# EAGLE design stm32 (EAGLE 9.6.2)
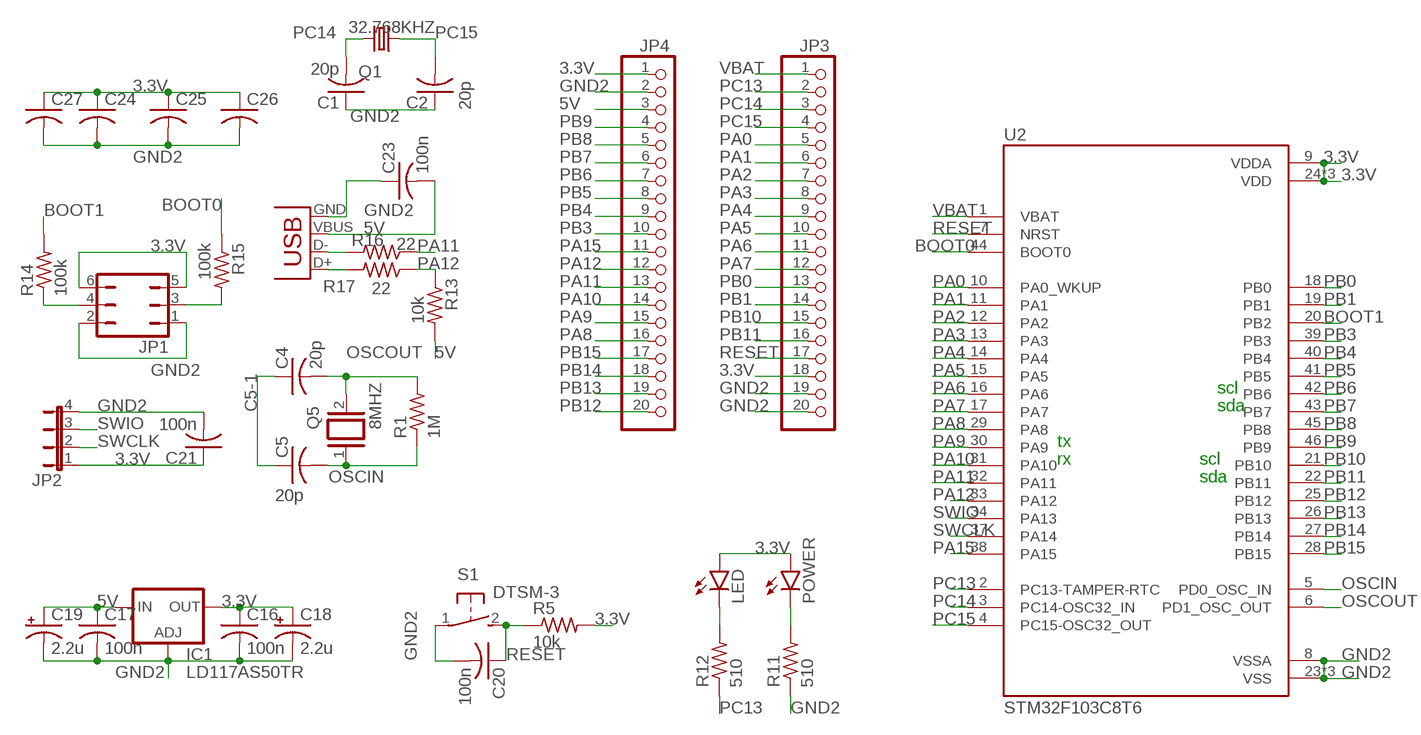
[diagram p0: schematic, sheet 1]

## Parts
C1  20p  C-USC1206  [C1206]
C2  20p  C-USC1206  [C1206]
C4  20p  C-USC1206  [C1206]
C5  20p  C-USC1206  [C1206]
C16  100n  C-USC1206  [C1206]
C17  100n  C-USC1206  [C1206]
C18  2.2u  CPOL-USE2-5  [E2-5]
C19  2.2u  CPOL-USE2-5  [E2-5]
C20  100n  C-USC1206  [C1206]
C21  100n  C-USC1206  [C1206]
C23  100n  C-USC1206  [C1206]
C24  C-USC1206  [C1206]
C25  C-USC1206  [C1206]
C26  C-USC1206  [C1206]
C27  C-USC1206  [C1206]
IC1  LD117AS50TR  [SOT223]
JP1  JP3Q  [JP3Q]
JP2  JP4E  [JP4]
JP3  PINHD-1X20  [1X20]
JP4  PINHD-1X20  [1X20]
LED  LEDCHIPLED_1206  [CHIPLED_1206]
POWER  LEDCHIPLED_1206  [CHIPLED_1206]
Q1  32.768KHZ  CRYSTALTC26H  [TC26H]
Q5  8MHZ  XTAL/S  [QS]
R1  1M  R-US_R1206  [R1206]
R5  10k  R-US_R1206  [R1206]
R11  510  R-US_R1206  [R1206]
R12  510  R-US_R1206  [R1206]
R13  10k  R-US_R1206  [R1206]
R14  100k  R-US_R1206  [R1206]
R15  100k  R-US_R1206  [R1206]
R16  22  R-US_R1206  [R1206]
R17  22  R-US_R1206  [R1206]
S1  DTSM-3  [DTSM-3]
U2  STM32F103C8T6  [QFP50P900X900X160-48N]
X1  USB-MB-S  [USB-MB-S]

## Nets
3.3V: C16.1 C18.+ C21.1 C24.1 C25.1 C26.1 C27.1 IC1.4(OUT) JP1.5 JP1.6 JP2.1 JP3.18 JP4.1 LED.A POWER.A R5.2 U2.9(VDDA) U2.24(VDD) U2.36(VDD) U2.48(VDD)
5V: C17.1 C19.+ C23.2 IC1.3(IN) JP4.3 R13.2 X1.VBUS
BOOT0: R15.1 U2.44(BOOT0)
BOOT1: R14.2 U2.20(PB2)
C5-1: C4.1 C5.1
GND2: C1.1 C2.1 C16.2 C17.2 C18.- C19.- C20.2 C21.2 C23.1 C24.2 C25.2 C26.2 C27.2 IC1.1(ADJ) JP1.1 JP1.2 JP2.4 JP3.19 JP3.20 JP4.2 R11.1 S1.1 U2.8(VSSA) U2.23(VSS) U2.35(VSS) U2.47(VSS) X1.GND
N$5: LED.C R12.2
N$6: POWER.C R11.2
N$8: JP1.3 R15.2
N$11: JP1.4 R14.1
N$19: R16.2 X1.D-
N$21: R17.2 X1.D+
OSCIN: C5.2 Q5.1 R1.1 U2.5(PD0_OSC_IN)
OSCOUT: C4.2 Q5.2 R1.2 U2.6(PD1_OSC_OUT)
PA0: JP3.5 U2.10(PA0_WKUP)
PA1: JP3.6 U2.11(PA1)
PA2: JP3.7 U2.12(PA2)
PA3: JP3.8 U2.13(PA3)
PA4: JP3.9 U2.14(PA4)
PA5: JP3.10 U2.15(PA5)
PA6: JP3.11 U2.16(PA6)
PA7: JP3.12 U2.17(PA7)
PA8: JP4.16 U2.29(PA8)
PA9: JP4.15 U2.30(PA9)
PA10: JP4.14 U2.31(PA10)
PA11: JP4.13 R16.1 U2.32(PA11)
PA12: JP4.12 R13.1 R17.1 U2.33(PA12)
PA15: JP4.11 U2.38(PA15)
PB0: JP3.13 U2.18(PB0)
PB1: JP3.14 U2.19(PB1)
PB3: JP4.10 U2.39(PB3)
PB4: JP4.9 U2.40(PB4)
PB5: JP4.8 U2.41(PB5)
PB6: JP4.7 U2.42(PB6)
PB7: JP4.6 U2.43(PB7)
PB8: JP4.5 U2.45(PB8)
PB9: JP4.4 U2.46(PB9)
PB10: JP3.15 U2.21(PB10)
PB11: JP3.16 U2.22(PB11)
PB12: JP4.20 U2.25(PB12)
PB13: JP4.19 U2.26(PB13)
PB14: JP4.18 U2.27(PB14)
PB15: JP4.17 U2.28(PB15)
PC13: JP3.2 R12.1 U2.2(PC13-TAMPER-RTC)
PC14: C1.2 JP3.3 Q1.2 U2.3(PC14-OSC32_IN)
PC15: C2.2 JP3.4 Q1.1 U2.4(PC15-OSC32_OUT)
RESET: C20.1 JP3.17 R5.1 S1.2 U2.7(NRST)
SWCLK: JP2.2 U2.37(PA14)
SWIO: JP2.3 U2.34(PA13)
VBAT: JP3.1 U2.1(VBAT)

## Notes on the sheet
- scl
- sda
- tx
- rx | scl
- sda

## Library data of the parts
C1 C2 C4 C5 C16 C17 C20 C21 C23-C27 = rcl:C-US: CAPACITOR, American symbol; SPICEPREFIX: C
C18 C19 = rcl:CPOL-US: POLARIZED CAPACITOR, American symbol; SPICEPREFIX: C
IC1 = v-reg:LD117A?*: Low drop fixed and adjustable positive voltage regulators 1 A Source: http://www.st.com/stonline/products/literature/ds/7194/ld1117axx.pdf
JP1 = jumper:JP3Q: JUMPER
JP2 = jumper:JP4E: JUMPER
JP3 JP4 = MIA_LIBRARY-2-2-2:PINHD-1X20: PIN HEADER
LED POWER = led:LED: LED OSRAM: - CHIPLED LG R971, LG N971, LY N971, LG Q971, LY Q971, LO R971, LY R971 LH N974, LH R974 LS Q976, LO Q976, LY Q976 LO Q996 - Hyper CHIPLED LW Q18S LB Q993, LB Q99A, LB R99A - SideLED LS A670, LO A670, LY A670, LG A670, LP A670 LB A673, LV A673, LT A673, LW A673 LH A674 LY A675 LS A676, LA A676, LO A676, LY A676, LW A676 LS A679, LY A679, LG A679 - Hyper Micro SIDELED® LS Y876, LA Y876, LO Y876, LY Y876 LT Y87S - SmartLED LW L88C, LW L88S LB L89C, LB L89S, LG L890 LS L89K, LO L89K, LY L89K LS L896, LA L896, LO L896, LY L896 - TOPLED LS T670, LO T670, LY T670, LG T670, LP T670 LSG T670, LSP T670, LSY T670, LOP T670, LYG T670 LG T671, LOG T671, LSG T671 LB T673, LV T673, LT T673, LW T673 LH T674 LS T676, LA T676, LO T676, LY T676, LB T676, LH T676, LSB T676, LW T676 LB T67C, LV T67C, LT T67C, LS T67K, LO T67K, LY T67K, LW E67C LS E67B, LA E67B, LO E67B, LY E67B, LB E67C, LV E67C, LT E67C LW T67C LS T679, LY T679, LG T679 LS T770, LO T770, LY T770, LG T770, LP T770 LB T773, LV T773, LT T773, LW T773 LH T774 LS E675, LA E675, LY E675, LS T675 LS T776, LA T776, LO T776, LY T776, LB T776 LHGB T686 LT T68C, LB T68C - Hyper Mini TOPLED® LB M676 - Mini TOPLED Santana® LG M470 LS M47K, LO M47K, LY M47K Source: http://www.osram.convergy.de LUXEON: - LUMILED® LXK2-PW12-R00, LXK2-PW12-S00, LXK2-PW14-U00, LXK2-PW14-V00 LXK2-PM12-R00, LXK2-PM12-S00, LXK2-PM14-U00 LXK2-PE12-Q00, LXK2-PE12-R00, LXK2-PE12-S00, LXK2-PE14-T00, LXK2-PE14-U00 LXK2-PB12-K00, LXK2-PB12-L00, LXK2-PB12-M00, LXK2-PB14-N00, LXK2-PB14-P00, LXK2-PB14-Q00 LXK2-PR12-L00, LXK2-PR12-M00, LXK2-PR14-Q00, LXK2-PR14-R00 LXK2-PD12-Q00, LXK2-PD12-R00, LXK2-PD12-S00 LXK2-PH12-R00, LXK2-PH12-S00 LXK2-PL12-P00, LXK2-PL12-Q00, LXK2-PL12-R00 Source: www.luxeon.com KINGBRIGHT: KA-3528ASYC Source: www.kingbright.com
Q1 = crystal:CRYSTAL: CRYSTAL; OC_FARNELL: unknown; OC_NEWARK: unknown
Q5 = special:XTAL/S: CRYSTAL
R1 R5 R11-R17 = rcl:R-US_: RESISTOR, American symbol; SPICEPREFIX: R
S1 = switch-tact:DTSM-3
U2 = STM32F103C8T6:STM32F103C8T6: Mainstream Performance line, ARM Cortex-M3 MCU with 64 Kbytes Flash, 72 MHz CPU, motor control, USB and CAN; AVAILABILITY: Unavailable; DESCRIPTION: Mainstream Performance line, ARM Cortex-M3 MCU with 64 Kbytes Flash, 72 MHz CPU, motor control, USB and CAN; MF: STMicroelectronics; MP: STM32F103C8T6; PACKAGE: LQFP-48 STMicroelectronics; PRICE: None
X1 = MIA_LIBRARY (2):USB: USB Connectors

## Board
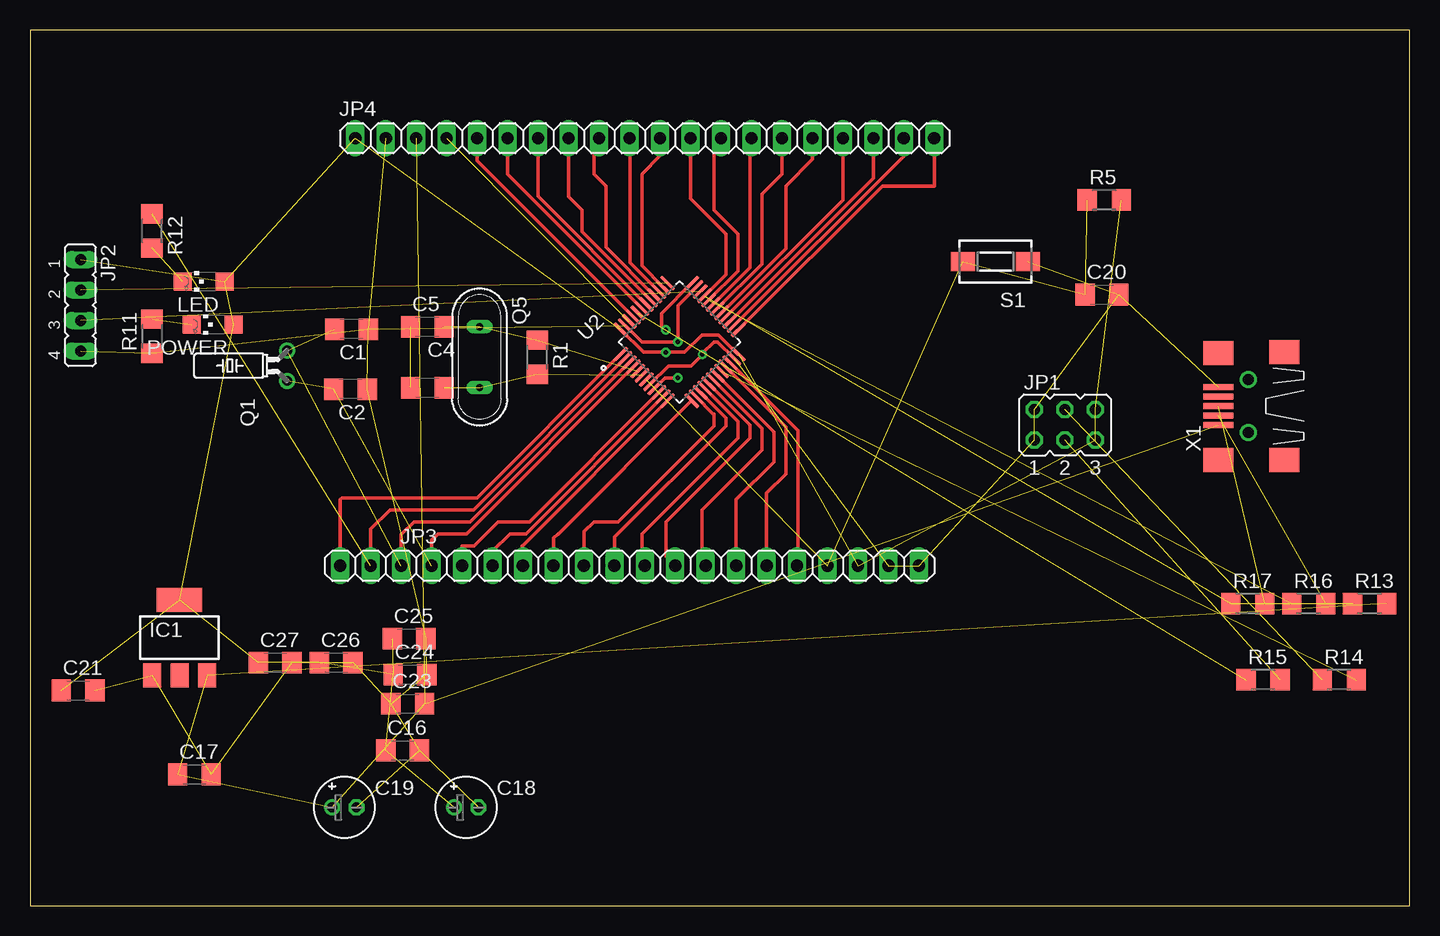
[diagram p1: board, top side]
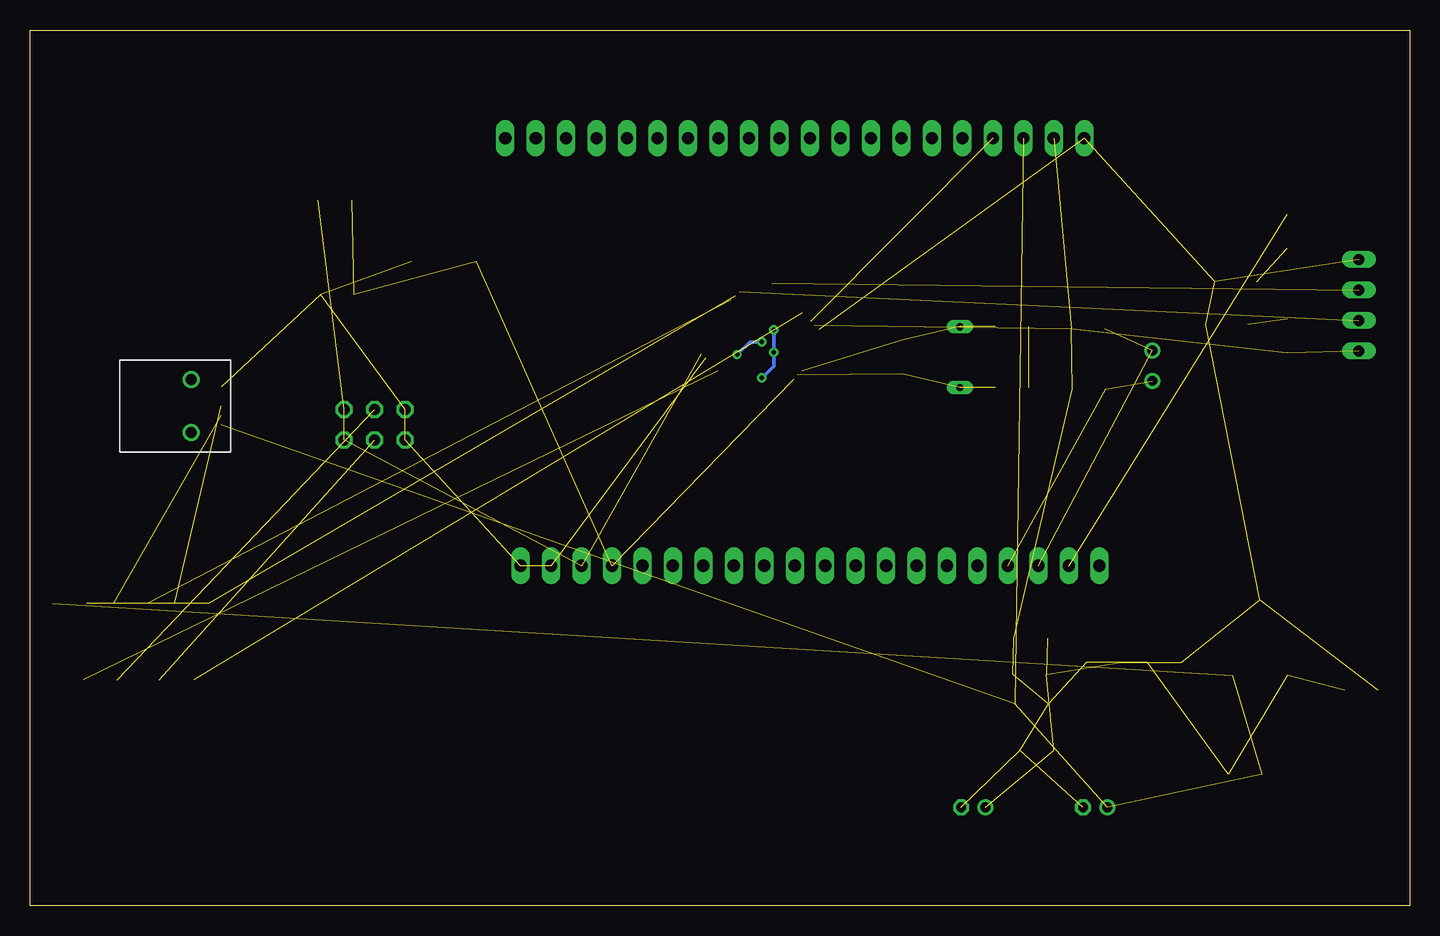
[diagram p2: board, bottom side, seen from below]

Size 115 x 73 mm. Coordinates in mm from the lower left corner, seen from the top.
Outline: 0,0 115,0 115,73 0,73 0,0
Copper layers (1*16): Top 0.035mm / dielectric 1.5mm / Bottom 0.035mm
Design rules "default": minimum track width 6mil, minimum drill 0.35mm, track to track 6mil, track to pad 6mil, pad to pad 6mil, via to via 6mil, smd to smd 6mil, copper to edge 40mil, drill to drill 6mil, minimum pad ring 10mil, minimum via ring 8mil, stop-mask expansion 4mil, vias tented up to drill 0mil, thermal gap 10mil

### Footprints (pad centres in the part's own frame; a part is rotated, then mirrored left to right if it is on the bottom)
C1206 = smd 1.6 x 1.8: 1 -1.4,0; 2 1.4,0
E2-5 = drill 0.813 pad 1.27: + -1.016,0 | drill 0.813 pad 1.27 octagon: - 1.016,0
SOT223 = smd 1.5 x 2: 1 -2.3,-3.15; 2 0,-3.15; 3 2.3,-3.15 | smd 3.8 x 2: 4 0,3.15
JP3Q = drill 0.914 octagon: 1 -2.54,-1.27; 2 -2.54,1.27; 3 0,-1.27; 4 0,1.27; 5 2.54,-1.27; 6 2.54,1.27
JP4 = drill 0.914 long: 1 -3.81,0; 2 -1.27,0; 3 1.27,0; 4 3.81,0
1X20 = drill 1.016 long: 1 -24.13,0; 2 -21.59,0; 3 -19.05,0; 4 -16.51,0; 5 -13.97,0; 6 -11.43,0; 7 -8.89,0; 8 -6.35,0; 9 -3.81,0; 10 -1.27,0; 11 1.27,0; 12 3.81,0; 13 6.35,0; 14 8.89,0; 15 11.43,0; 16 13.97,0; 17 16.51,0; 18 19.05,0; 19 21.59,0; 20 24.13,0
CHIPLED_1206 = smd 1.5 x 1.5: A 0,-1.75; C 0,1.75
TC26H = drill 0.813: 1 -1.27,0; 2 1.27,0
QS = drill 0.61 long: 1 -2.54,0; 2 2.54,0
R1206 = smd 1.6 x 1.803: 1 -1.422,0; 2 1.422,0
DTSM-3 = smd 2 x 1.6: 1 -2.7,0; 2 2.7,0
QFP50P900X900X160-48N = smd 1.56 x 0.28: 1 -4.18,2.75; 2 -4.18,2.25; 3 -4.18,1.75; 4 -4.18,1.25; 5 -4.18,0.75; 6 -4.18,0.25; 7 -4.18,-0.25; 8 -4.18,-0.75; 9 -4.18,-1.25; 10 -4.18,-1.75; 11 -4.18,-2.25; 12 -4.18,-2.75; 25 4.18,-2.75; 26 4.18,-2.25; 27 4.18,-1.75; 28 4.18,-1.25; 29 4.18,-0.75; 30 4.18,-0.25; 31 4.18,0.25; 32 4.18,0.75; 33 4.18,1.25; 34 4.18,1.75; 35 4.18,2.25; 36 4.18,2.75 | smd 0.28 x 1.56: 13 -2.75,-4.18; 14 -2.25,-4.18; 15 -1.75,-4.18; 16 -1.25,-4.18; 17 -0.75,-4.18; 18 -0.25,-4.18; 19 0.25,-4.18; 20 0.75,-4.18; 21 1.25,-4.18; 22 1.75,-4.18; 23 2.25,-4.18; 24 2.75,-4.18; 37 2.75,4.18; 38 2.25,4.18; 39 1.75,4.18; 40 1.25,4.18; 41 0.75,4.18; 42 0.25,4.18; 43 -0.25,4.18; 44 -0.75,4.18; 45 -1.25,4.18; 46 -1.75,4.18; 47 -2.25,4.18; 48 -2.75,4.18
USB-MB-S = smd 2.5 x 0.5: D+ 2.5,0; D- 2.5,0.8; GND 2.5,-1.6; ID 2.5,-0.8; VBUS 2.5,1.6 | smd 2.5 x 2: P$1 -3,-4.5; P$2 -3,4.5; P$3 2.5,-4.4; P$4 2.5,4.5 | drill 0.9: P$5 0,2.2; P$6 0,-2.2

### Placement (x,y rotation side)
C1  26.8,48.05 180 top
C2  26.72,43.05 180 top
C4  33.13,43.18 0 top
C5  33.13,48.26 0 top
C16  31.06,12.94 0 top
C17  13.71,10.94 0 top
C18  36.36,8.18 0 top
C19  26.2,8.18 0 top
C20  89.36,50.94 0 top
C21  4.01,17.94 0 top
C23  31.49,16.83 0 top
C24  31.68,19.26 0 top
C25  31.6,22.26 0 top
C26  25.52,20.26 0 top
C27  20.44,20.26 0 top
IC1  12.47,22.32 0 top
JP1  86.28,40.08 0 top
JP2  4.21,50.05 270 top
JP3  49.98,28.33 0 top
JP4  51.25,63.98 0 top
LED  14.47,52.03 90 top
POWER  15.22,48.44 90 top
Q1  21.43,45.01 90 top
Q5  37.48,45.72 270 top
R1  42.29,45.72 270 top
R5  89.55,58.83 0 top
R11  10.17,47.47 90 top
R12  10.18,56.24 270 top
R13  111.68,25.18 0 top
R14  109.14,18.83 0 top
R15  102.79,18.83 0 top
R16  106.6,25.18 0 top
R17  101.52,25.18 0 top
S1  80.48,53.68 180 top
U2  54.15,46.99 45 top
X1  101.56,41.65 180 top

### Tracks (layer width: path | path; a pad name or v marks a point on that pad's centre or on a via)
3.3V  (via drill 0.35)  (16 unrouted)
  Top 0.3: U2.48 51.12,46.12 v53,46.12 54.58,46.12 56,47.55 57.4,47.55 58.97,45.98 U2.24 | U2.36 52.62,49.35 52.62,48.38 v53,48 | U2.9 52.93,44 v54,44
  Bottom 0.3: v54,44 53,45 v53,46.12 v53,48
5V  (6 unrouted)
BOOT0  (1 unrouted)
BOOT1  (1 unrouted)
C5-1  (1 unrouted)
GND2  (via drill 0.35)  (23 unrouted)
  Top 0.3: U2.35 54,50.02 v54,47 51,47 49.65,48.35 U2.47 | U2.8 53.22,45 55.09,45 v56.05,45.95 56.05,46.05 57,47 57.32,47 U2.23
  Bottom 0.3: v56.05,45.95 55,47 v54,47
N$5  (1 unrouted)
N$6  (1 unrouted)
N$8  (1 unrouted)
N$11  (1 unrouted)
N$19  (1 unrouted)
N$21  (1 unrouted)
OSCIN  (3 unrouted)
OSCOUT  (3 unrouted)
PA0
  Top 0.3: U2.10 41.63,32 39,32 37,30 36,30 JP3.5
PA1
  Top 0.3: U2.11 41.34,31 40,31 38.55,29.55 JP3.6
PA2
  Top 0.3: U2.12 41.05,30 41,30 41,28.42 JP3.7
PA3
  Top 0.3: U2.13 44.07,31 44,31 43.63,30.63 JP3.8
PA4
  Top 0.3: U2.14 56.96,41 57,41 57,40 49,32 47,32 46.17,31.17 JP3.9
PA5
  Top 0.3: U2.15 58,40.66 58,40 48.71,30.71 JP3.10
PA6
  Top 0.3: U2.16 59,40.37 59,39 51,31 51,28.58 JP3.11
PA7
  Top 0.3: U2.17 60,40.08 60,39 53,32 53,29.12 JP3.12
PA8
  Top 0.3: U2.29 63,54.78 63,60 65.22,62.22 JP4.16
PA9
  Top 0.3: U2.30 61,53.49 61,59.3 62.68,60.98 JP4.15
PA10
  Top 0.3: U2.31 60,53.19 60,63.84 JP4.14
PA11  (1 unrouted)
  Top 0.3: U2.32 59,52.9 59,56 57,58 57,63.38 JP4.13
PA12  (2 unrouted)
  Top 0.3: U2.33 58,52.61 58,56 55.06,58.94 JP4.12
PA15
  Top 0.3: JP4.11 52.52,62.52 51,61 51,53.34 52.78,51.55 U2.38
PB0
  Top 0.3: U2.18 61,39.79 61,38 56,33 56,28.66 JP3.13
PB1
  Top 0.3: U2.19 62,39.49 62,37 58.87,33.87 JP3.14
PB3
  Top 0.3: U2.39 50,53.62 50,63.96 JP4.10
PB4
  Top 0.3: U2.40 48,54.91 48,60 47,61 47,63.54 JP4.9
PB5
  Top 0.3: JP4.8 44.9,59.1 46,58 46,56.2 U2.41
PB6
  Top 0.3: U2.42 42.36,59.13 JP4.7
PB7
  Top 0.3: U2.43 39.82,60.97 JP4.6
PB8
  Top 0.3: U2.45 37.28,62.09 JP4.5
PB9  (1 unrouted)
PB10
  Top 0.3: U2.21 63,39.91 63,36 61.41,34.41 JP3.15
PB11
  Top 0.3: U2.22 64,39.62 64,28.38 JP3.16
PB12
  Top 0.3: U2.25 71.05,60 75.4,60 75.4,63.96 JP4.20
PB13
  Top 0.3: U2.26 72.84,62.5 JP4.19
PB14
  Top 0.3: U2.27 70.3,60.66 JP4.18
PB15
  Top 0.3: U2.28 67.76,58.83 JP4.17
PC13  (1 unrouted)
  Top 0.3: U2.2 36.98,33 30,33 28.39,31.39 JP3.2
PC14  (2 unrouted)
  Top 0.3: U2.3 36.69,32 32,32 30.93,30.93 JP3.3
PC15  (2 unrouted)
  Top 0.3: U2.4 36.39,31 34,31 33.47,30.47 JP3.4
RESET  (4 unrouted)
SWCLK  (1 unrouted)
SWIO  (1 unrouted)
VBAT
  Top 0.3: U2.1 37.27,34 26,34 25.85,33.85 JP3.1